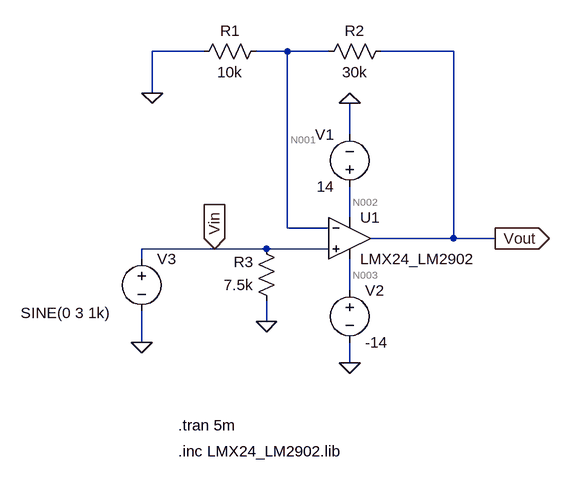
[diagram p0: schematic LM324.asc]
LM324.asc, the LTspice schematic file:
Version 4.1
SHEET 1 880 680
WIRE -48 -128 -128 -128
WIRE 80 -128 32 -128
WIRE 144 -128 80 -128
WIRE 336 -128 224 -128
WIRE -128 -64 -128 -128
WIRE 176 0 176 -48
WIRE 176 128 176 80
WIRE 80 144 80 -128
WIRE 144 144 80 144
WIRE 336 160 336 -128
WIRE 336 160 208 160
WIRE 400 160 336 160
WIRE -32 176 -144 176
WIRE 48 176 -32 176
WIRE 144 176 48 176
WIRE -144 192 -144 176
WIRE 176 240 176 192
WIRE 48 288 48 256
WIRE -144 320 -144 272
WIRE 176 352 176 320
FLAG 176 352 0
FLAG 176 -48 0
FLAG -32 176 Vin
IOPIN -32 176 In
FLAG 48 288 0
FLAG 400 160 Vout
IOPIN 400 160 Out
FLAG -128 -64 0
FLAG -144 320 0
SYMBOL OpAmps\\opamp2 176 96 R0
SYMATTR InstName U1
SYMATTR Value LMX24_LM2902
SYMBOL res 48 -144 R90
WINDOW 0 0 56 VBottom 2
WINDOW 3 32 56 VTop 2
SYMATTR InstName R1
SYMATTR Value 10k
SYMBOL res 240 -144 R90
WINDOW 0 0 56 VBottom 2
WINDOW 3 32 56 VTop 2
SYMATTR InstName R2
SYMATTR Value 30k
SYMBOL res 64 272 R180
WINDOW 0 36 76 Left 2
WINDOW 3 36 40 Left 2
SYMATTR InstName R3
SYMATTR Value 7.5k
SYMBOL voltage 176 96 R180
WINDOW 0 24 96 Left 2
WINDOW 3 24 16 Left 2
SYMATTR InstName V1
SYMATTR Value 14
SYMBOL voltage 176 224 R0
SYMATTR InstName V2
SYMATTR Value -14
SYMBOL voltage -144 176 R0
WINDOW 3 -186 99 Left 2
WINDOW 123 0 0 Left 0
WINDOW 39 0 0 Left 0
SYMATTR Value SINE(0 3 1k)
SYMATTR InstName V3
TEXT -88 448 Left 2 !.tran 5m
TEXT -88 488 Left 2 !.inc LMX24_LM2902.lib

The netlist it stands for:
* LM324.asc
X§U1 Vin N001 N002 N003 Vout LMX24_LM2902  ; pins In+ In- V+ V- OUT
R1 N001 0 10k
R2 Vout N001 30k
R3 0 Vin 7.5k
V1 N002 0 14
V2 N003 0 -14
V3 Vin 0 SINE(0 3 1k)
.tran 5m
.inc LMX24_LM2902.lib
.backanno
.end

* Results of the author's LTspice run, read from the files saved beside the schematic
* Operating Point, zero values left out:
*   V(n001) = 2.926 mV
*   V(n002) = 14 V
*   V(n003) = -14 V
*   V(vout) = 11.16 mV
*   I(R1) = 292.6 nA
*   I(R2) = 274.6 nA
*   I(V1) = -175.3 µA
*   I(V2) = 175 µA
*   I(V3) = 20 nA
*   Ix(u1:in+) = -20 nA
*   Ix(u1:in-) = -18 nA
*   Ix(u1:out) = -274.6 nA
*   Ix(u1:vcc) = 175.3 µA
*   Ix(u1:vee) = -175 µA
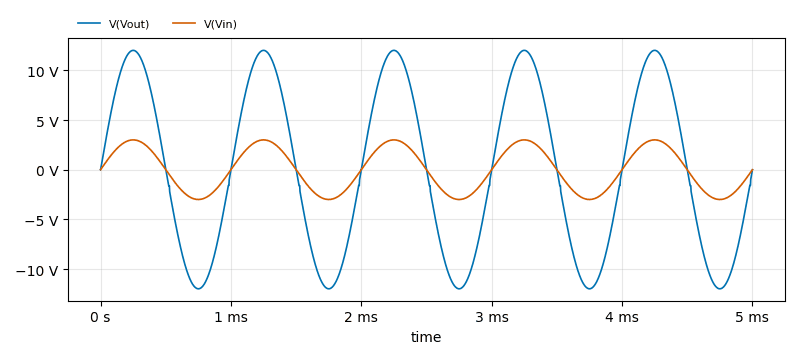
[diagram p1: Transient Analysis of LM324.asc, plotted from the saved traces]
* Transient Analysis, 1 run:
*   V(Vout): min -11.99 V, max 12.01 V, average 11.2 mV, rms 8.485 V, last -15.14 mV
*   V(Vin): min -3 V, max 3 V, average 0 V, rms 2.121 V, last 0 V